# Altium schematic sheet Microcontroleur.SchDoc
size A
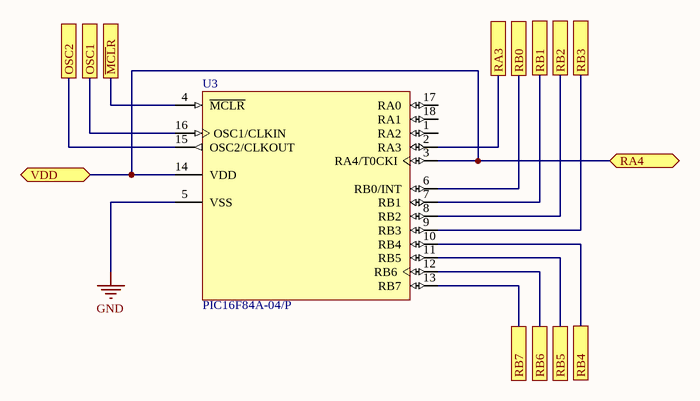
[diagram p0: Microcontroleur.SchDoc]

## Parts
U3  PIC16F84A-04/P  [PDIP300-P18]

## Ports
OSC1, OSC2, RA3, RA4, RB0, RB1, RB2, RB3, RB4, RB5, RB6, RB7, VDD, ~{MCL}R

## Nets
GND: U3.5(VSS)
~{MCL}R: U3.4(~{MCLR}) ; port ~{MCL}R
OSC1: U3.16(OSC1/CLKIN) ; port OSC1
OSC2: U3.15(OSC2/CLKOUT) ; port OSC2
RA3: U3.2(RA3) ; port RA3
RA4: U3.3(RA4/T0CKI) U3.14(VDD) ; port VDD, port RA4
RB0: U3.6(RB0/INT) ; port RB0
RB1: U3.7(RB1) ; port RB1
RB2: U3.8(RB2) ; port RB2
RB3: U3.9(RB3) ; port RB3
RB4: U3.10(RB4) ; port RB4
RB5: U3.11(RB5) ; port RB5
RB6: U3.12(RB6) ; port RB6
RB7: U3.13(RB7) ; port RB7

Not connected (* = marked no-connect by the designer): U3 1(RA2) 17(RA0) 18(RA1)

## Library data of the parts
U3 = PIC16F84A-04/P: Enhanced FLASH/EEPROM 8-Bit Microcontroller, 1K (x14-Bit words) FLASH, 68 Bytes RAM, 4 MHz, 18-Pin PDIP, Standard VDD Range, Commercial Temperature; Published: 11-Oct-2004; LatestRevisionDate: 29-Jan-2009; LatestRevisionNote: Sch. layout revised. 3D Model Removed.; DatasheetVersion: revB, Aug-2001; PackageVersion: revBB, Aug-2009; PackageReference: PDIP300-P18; Publisher: Altium Limited; PackageDescription: 18-Lead Plastic Dual In-Line (P) - 300 mil Body [PDIP]; Supplier 1: Digi-Key; Supplier Part Number 1: PIC16F84A-04/P-ND; Supplier 2: Farnell; Supplier Part Number 2: 1523947; Supplier 3: Farnell; Supplier Part Number 3: 9760865; Code_JEDEC: MS-001; ComponentLink1Description: Datasheet; ComponentLink1URL: http://ww1.microchip.com/downloads/en/DeviceDoc/35007b.pdf; ComponentLink2Description: Packaging Specification; ComponentLink2URL: http://www.microchip.com/stellent/groups/techpub_sg/documents/packagingspec/en012702.pdf; ComponentLink3Description: Microchip.com Home; ComponentLink3URL: http://www.microchip.com/